# Altium schematic sheet CtDPS_Stage.SchDoc
size B; SheetNumber: 2; SheetTotal: 2
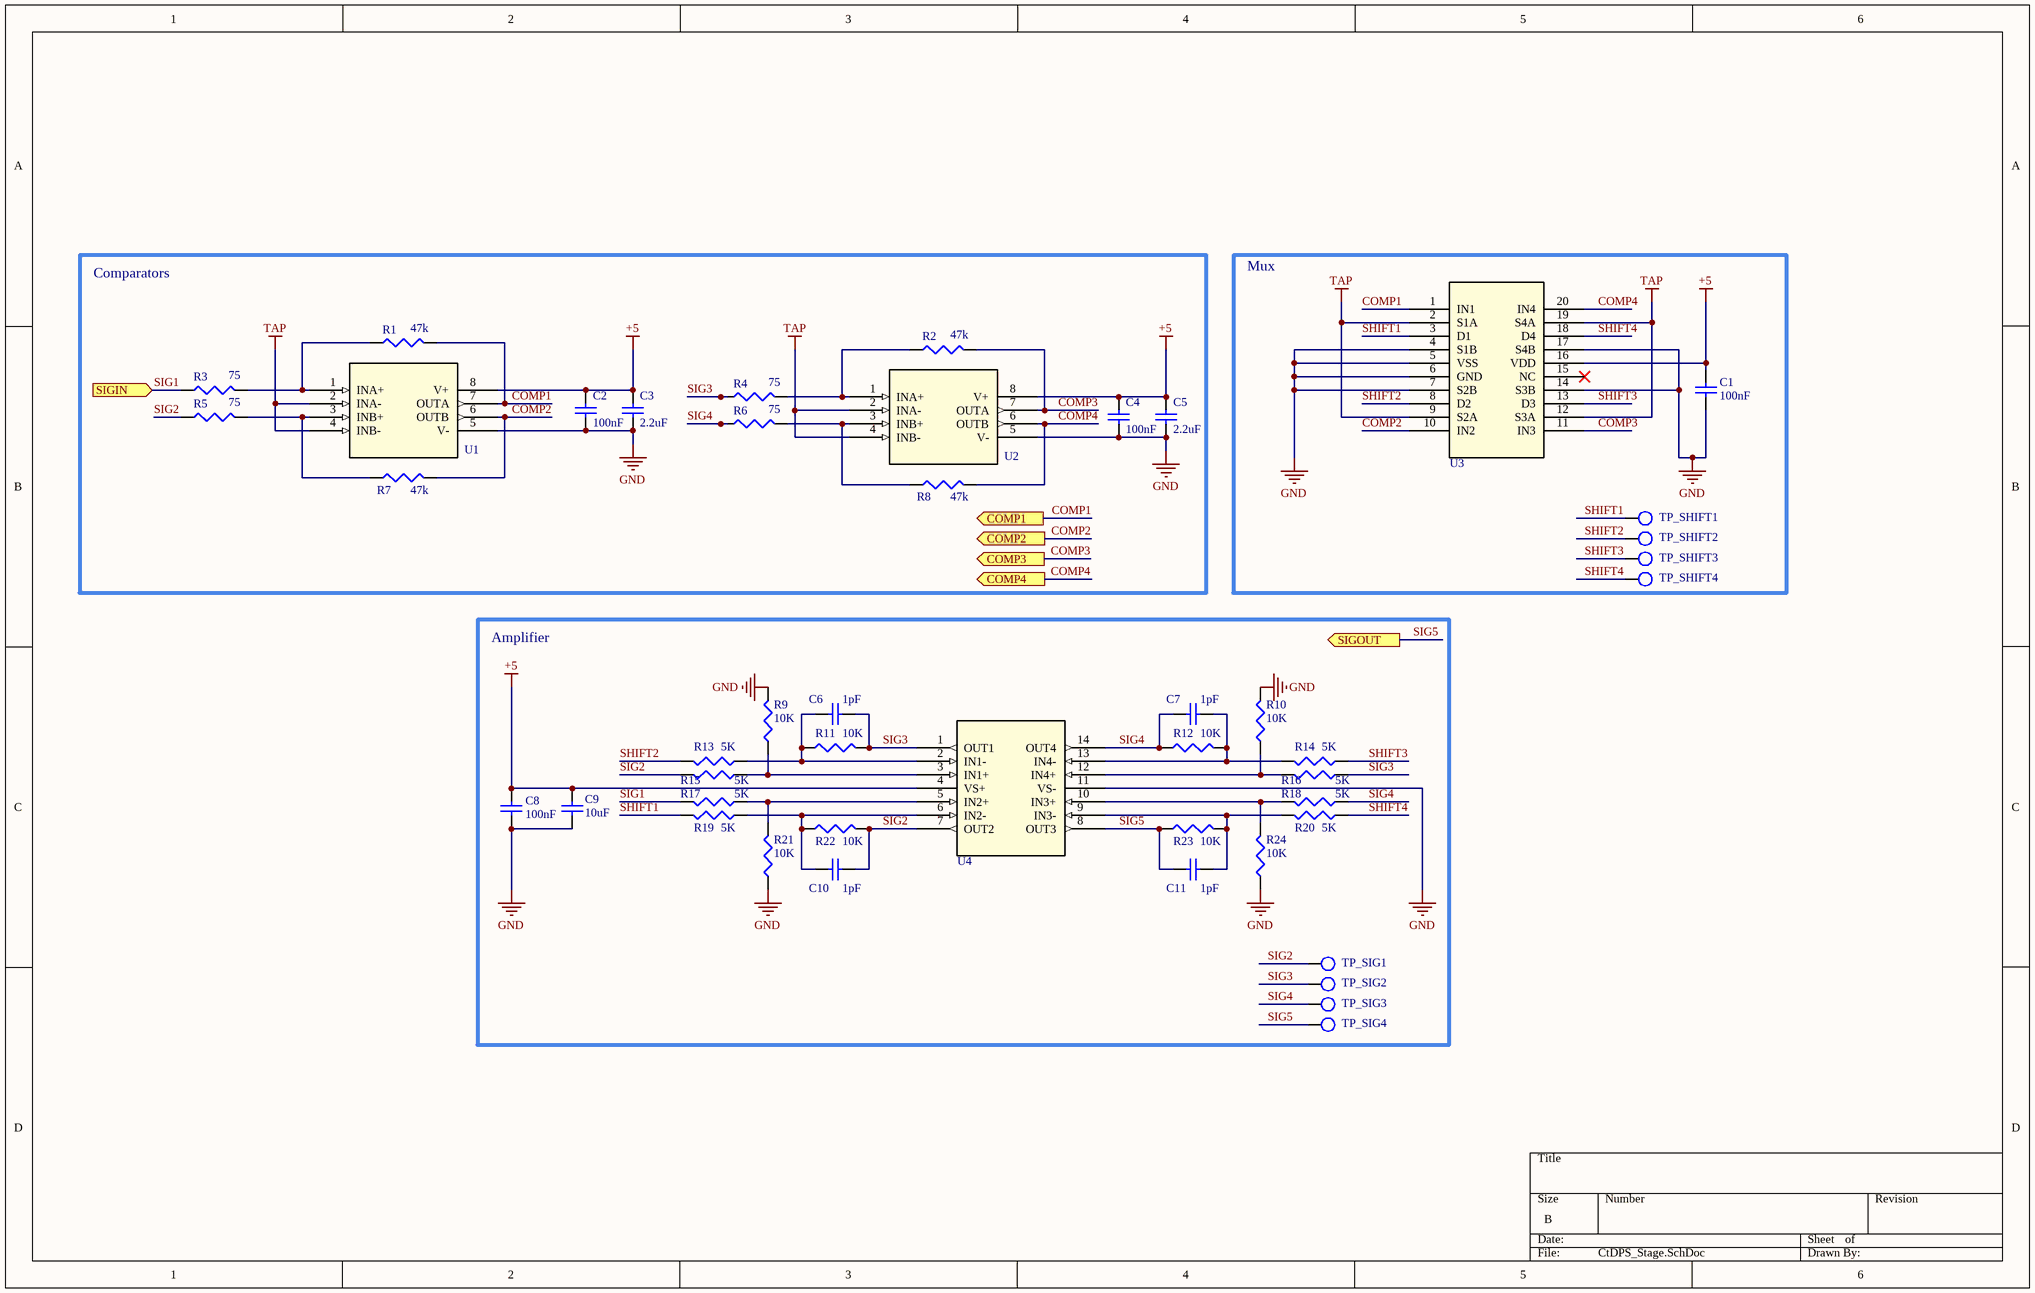
[diagram p0: CtDPS_Stage.SchDoc]

## Parts
C1  100nF  [C_0402]
C2  100nF  [C_0402]
C3  2.2uF  [C_0402]
C4  100nF  [C_0402]
C5  2.2uF  [C_0402]
C6  1pF  [C_0402]
C7  1pF  [C_0402]
C8  100nF  [C_0402]
C9  10uF  [C_0402]
C10  1pF  [C_0402]
C11  1pF  [C_0402]
R1  47k  [RES_0603]
R2  47k  [RES_0603]
R3  75  [RES_0603]
R4  75  [RES_0603]
R5  75  [RES_0603]
R6  75  [RES_0603]
R7  47k  [RES_0603]
R8  47k  [RES_0603]
R9  10K  [RES_0402]
R10  10K  [RES_0402]
R11  10K  [RES_0402]
R12  10K  [RES_0402]
R13  5K  [RES_0402]
R14  5K  [RES_0402]
R15  5K  [RES_0402]
R16  5K  [RES_0402]
R17  5K  [RES_0402]
R18  5K  [RES_0402]
R19  5K  [RES_0402]
R20  5K  [RES_0402]
R21  10K  [RES_0402]
R22  10K  [RES_0402]
R23  10K  [RES_0402]
R24  10K  [RES_0402]
TP_SHIFT1  TESTPOINT  [TESTPOINT]  (value not drawn)
TP_SHIFT2  TESTPOINT  [TESTPOINT]  (value not drawn)
TP_SHIFT3  TESTPOINT  [TESTPOINT]  (value not drawn)
TP_SHIFT4  TESTPOINT  [TESTPOINT]  (value not drawn)
TP_SIG1  TESTPOINT  [TESTPOINT]  (value not drawn)
TP_SIG2  TESTPOINT  [TESTPOINT]  (value not drawn)
TP_SIG3  TESTPOINT  [TESTPOINT]  (value not drawn)
TP_SIG4  TESTPOINT  [TESTPOINT]  (value not drawn)
U1  TLV3502AIDR  [TLV3502AIDR]  (value not drawn)
U2  TLV3502AIDR  [TLV3502AIDR]  (value not drawn)
U3  ADG734BRUZ-REEL  [ADG734BRUZ-REEL]  (value not drawn)
U4  ADA4891-4ARZ-R7  [ADA4891-4ARZ-R7]  (value not drawn)

## Blocks framed on the sheet
Comparators: C2-C5 R1-R8 U1 U2
Mux: C1 TP_SHIFT1-TP_SHIFT4 U3
Amplifier: C6-C11 R9-R24 TP_SIG1-TP_SIG4 U4

## Ports
COMP1 (out), COMP2 (out), COMP3 (out), COMP4 (out), SIGIN (in), SIGOUT (out)

## Nets
+5: C1.1 C2.1 C3.2 C4.1 C5.2 C8.1 C9.2 U1.8(V+) U2.8(V+) U3.16(VDD) U4.4(VS+)
GND: C1.2 C2.2 C3.1 C4.2 C5.1 C8.2 C9.1 R9.2 R10.2 R21.1 R24.1 U1.5(V-) U2.5(V-) U3.4(S1B) U3.5(VSS) U3.6(GND) U3.7(S2B) U3.14(S3B) U3.17(S4B) U4.11(VS-)
TAP: U1.2(INA-) U1.4(INB-) U2.2(INA-) U2.4(INB-) U3.2(S1A) U3.9(S2A) U3.12(S3A) U3.19(S4A)
COMP1: R1.2 U1.7(OUTA) U3.1(IN1) ; port COMP1
COMP2: R7.2 U1.6(OUTB) U3.10(IN2) ; port COMP2
COMP3: R2.2 U2.7(OUTA) U3.11(IN3) ; port COMP3
COMP4: R8.2 U2.6(OUTB) U3.20(IN4) ; port COMP4
SHIFT1: R19.1 TP_SHIFT1.1 U3.3(D1)
SHIFT2: R13.1 TP_SHIFT2.1 U3.8(D2)
SHIFT3: R14.2 TP_SHIFT3.1 U3.13(D3)
SHIFT4: R20.2 TP_SHIFT4.1 U3.18(D4)
SIG1: R3.1 R17.1 ; port SIGIN
SIG2: C10.2 R5.1 R15.1 R22.2 TP_SIG1.1 U4.7(OUT2)
SIG3: C6.2 R4.1 R11.2 R16.2 TP_SIG2.1 U4.1(OUT1)
SIG4: C7.1 R6.1 R12.1 R18.2 TP_SIG3.1 U4.14(OUT4)
SIG5: C11.1 R23.1 TP_SIG4.1 U4.8(OUT3) ; port SIGOUT
NetC6_1: C6.1 R11.1 R13.2 U4.2(IN1-)
NetC7_2: C7.2 R12.2 R14.1 U4.13(IN4-)
NetC10_1: C10.1 R19.2 R22.1 U4.6(IN2-)
NetC11_2: C11.2 R20.1 R23.2 U4.9(IN3-)
NetR1_1: R1.1 R3.2 U1.1(INA+)
NetR2_1: R2.1 R4.2 U2.1(INA+)
NetR5_2: R5.2 R7.1 U1.3(INB+)
NetR6_2: R6.2 R8.1 U2.3(INB+)
NetR9_1: R9.1 R15.2 U4.3(IN1+)
NetR10_1: R10.1 R16.1 U4.12(IN4+)
NetR17_2: R17.2 R21.2 U4.5(IN2+)
NetR18_1: R18.1 R24.2 U4.10(IN3+)

Not connected (* = marked no-connect by the designer): U3 15(NC)*

## Library data of the parts
C1-C11 = C_0402
  C1 C2 C4 C8: LCSC Part #: C1525
  C3 C5: LCSC Part #: C12530
  C6 C7 C10 C11: LCSC Part #: C1550
  C9: LCSC Part #: C15525
R1-R8 = RES_0603
  R1 R2 R7 R8: LCSC Part #: C25819
  R3-R6: LCSC Part #: C4275
R9-R24 = RES_0402
  R9-R12 R21-R24: LCSC Part #: C25744
  R13-R20: LCSC Part #: C5948099
U1 U2 = TLV3502AIDR: Dual 4.5ns Push-pull Rail-to-Rail Input, Rail-to-Rail Output TTL Comparators; LCSC Part #: C131165
U4 = ADA4891-4ARZ-R7: Quad Rail-to-Rail Op-Amp, 240 MHz, 170 V/µs, SOT-23-5; LCSC Part #: C654290
U3 = ADG734BRUZ-REEL: LCSC Part #: C579105